# EAGLE schematic rosco_m68k (EAGLE 9.4.2)

## Sheet 1 of 6
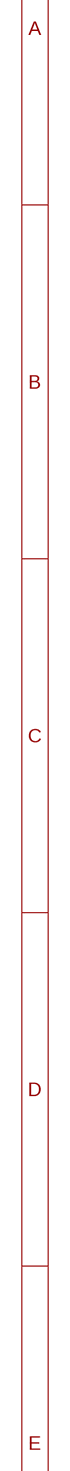
[diagram p0: schematic, sheet 1, part 1 of 2]
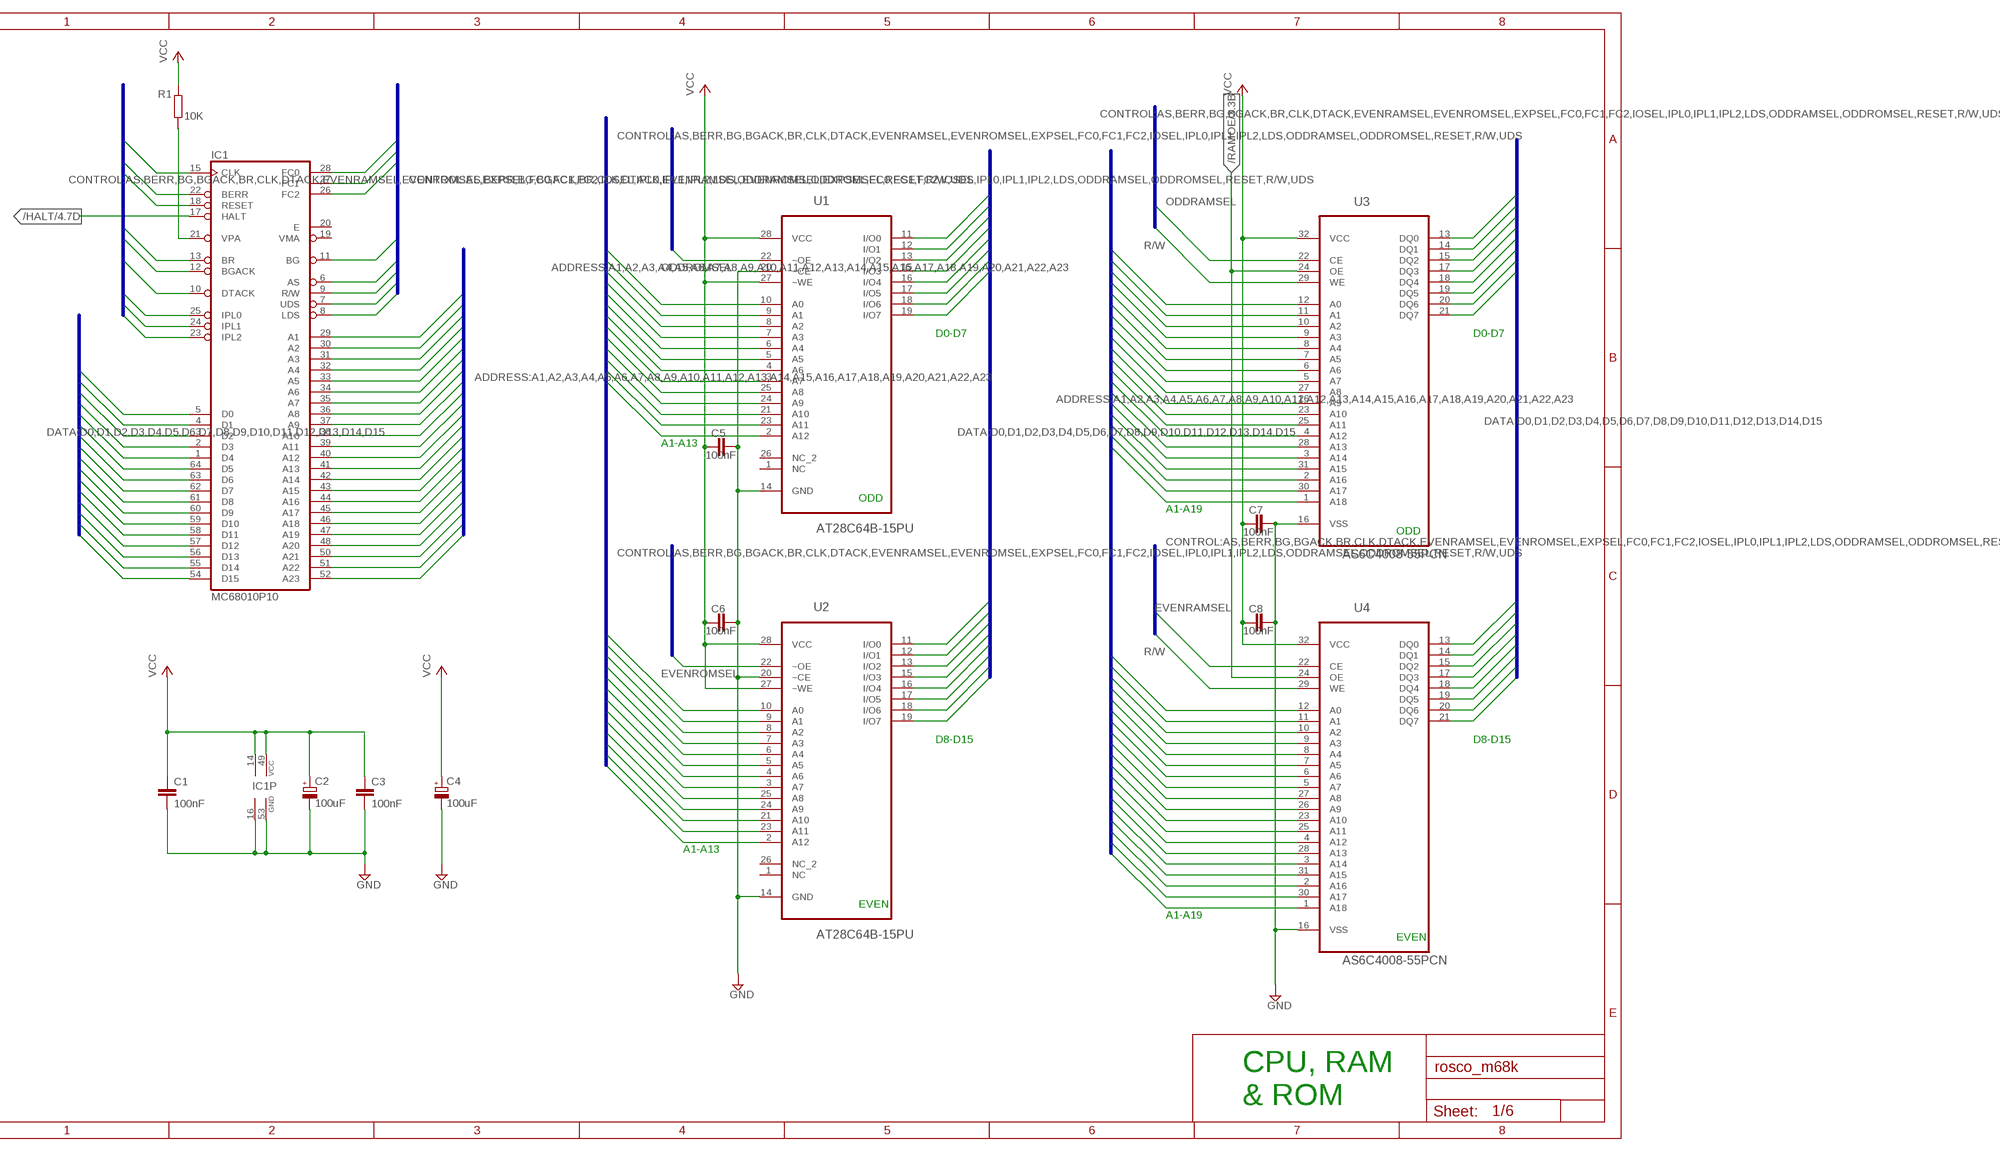
[diagram p1: schematic, sheet 1, part 2 of 2]

### Parts
C1  100nF  C2,5-3  [C2.5-3]
C2  100uF  CPOL-EUE2.5-5  [E2,5-5]
C3  100nF  C2,5-3  [C2.5-3]
C4  100uF  CPOL-EUE2.5-5  [E2,5-5]
C5  100nF  C2,5-3  [C2.5-3]
C6  100nF  C2,5-3  [C2.5-3]
C7  100nF  C2,5-3  [C2.5-3]
C8  100nF  C2,5-3  [C2.5-3]
IC1  MC68010P10  MC68000P  [DIL64]
R1  10K  R-EU_0207/10  [0207/10]
U1  AT28C64B-15PU  [DIP254P1524X482-28]
U2  AT28C64B-15PU  [DIP254P1524X482-28]
U3  AS6C4008-55PCN  [DIP254P1524X393-32]
U4  AS6C4008-55PCN  [DIP254P1524X393-32]

### Nets
/HALT: IC1.17(HALT) ; also sheet 4
/RAMOE: U3.24(OE) U4.24(OE) ; also sheet 3
A1: IC1.29(A1) U1.10(A0) U2.10(A0) U3.12(A0) U4.12(A0) ; also sheet 2,5
A2: IC1.30(A2) U1.9(A1) U2.9(A1) U3.11(A1) U4.11(A1) ; also sheet 2,5
A3: IC1.31(A3) U1.8(A2) U2.8(A2) U3.10(A2) U4.10(A2) ; also sheet 2,5
A4: IC1.32(A4) U1.7(A3) U2.7(A3) U3.9(A3) U4.9(A3) ; also sheet 2,5
A5: IC1.33(A5) U1.6(A4) U2.6(A4) U3.8(A4) U4.8(A4) ; also sheet 2,5
A6: IC1.34(A6) U1.5(A5) U2.5(A5) U3.7(A5) U4.7(A5) ; also sheet 5
A7: IC1.35(A7) U1.4(A6) U2.4(A6) U3.6(A6) U4.6(A6) ; also sheet 5
A8: IC1.36(A8) U1.3(A7) U2.3(A7) U3.5(A7) U4.5(A7) ; also sheet 5
A9: IC1.37(A9) U1.25(A8) U2.25(A8) U3.27(A8) U4.27(A8) ; also sheet 5
A10: IC1.38(A10) U1.24(A9) U2.24(A9) U3.26(A9) U4.26(A9) ; also sheet 5
A11: IC1.39(A11) U1.21(A10) U2.21(A10) U3.23(A10) U4.23(A10) ; also sheet 5
A12: IC1.40(A12) U1.23(A11) U2.23(A11) U3.25(A11) U4.25(A11) ; also sheet 5
A13: IC1.41(A13) U1.2(A12) U2.2(A12) U3.4(A12) U4.4(A12) ; also sheet 5
A14: IC1.42(A14) U3.28(A13) U4.28(A13) ; also sheet 5
A15: IC1.43(A15) U3.3(A14) U4.3(A14) ; also sheet 5
A16: IC1.44(A16) U3.31(A15) U4.31(A15) ; also sheet 5
A17: IC1.45(A17) U3.2(A16) U4.2(A16) ; also sheet 5
A18: IC1.46(A18) U3.30(A17) U4.30(A17) ; also sheet 2,5
A19: IC1.47(A19) U3.1(A18) U4.1(A18) ; also sheet 2,5
A20: IC1.48(A20) ; also sheet 2,5
A21: IC1.50(A21) ; also sheet 2,5
A22: IC1.51(A22) ; also sheet 2,5
A23: IC1.52(A23) ; also sheet 2,5
AS: IC1.6(AS) ; also sheet 2,3,5
BERR: IC1.22(BERR) ; also sheet 4,5
BG: IC1.11(BG) ; also sheet 5
BGACK: IC1.12(BGACK) ; also sheet 4,5
BR: IC1.13(BR) ; also sheet 4,5
CLK: IC1.15(CLK) ; also sheet 2,4,5
D0: IC1.5(D0) U1.11(I/O0) U3.13(DQ0) ; also sheet 2,5
D1: IC1.4(D1) U1.12(I/O1) U3.14(DQ1) ; also sheet 2,5
D2: IC1.3(D2) U1.13(I/O2) U3.15(DQ2) ; also sheet 2,5
D3: IC1.2(D3) U1.15(I/O3) U3.17(DQ3) ; also sheet 2,5
D4: IC1.1(D4) U1.16(I/O4) U3.18(DQ4) ; also sheet 2,5
D5: IC1.64(D5) U1.17(I/O5) U3.19(DQ5) ; also sheet 2,5
D6: IC1.63(D6) U1.18(I/O6) U3.20(DQ6) ; also sheet 2,5
D7: IC1.62(D7) U1.19(I/O7) U3.21(DQ7) ; also sheet 2,5
D8: IC1.61(D8) U2.11(I/O0) U4.13(DQ0) ; also sheet 5
D9: IC1.60(D9) U2.12(I/O1) U4.14(DQ1) ; also sheet 5
D10: IC1.59(D10) U2.13(I/O2) U4.15(DQ2) ; also sheet 5
D11: IC1.58(D11) U2.15(I/O3) U4.17(DQ3) ; also sheet 5
D12: IC1.57(D12) U2.16(I/O4) U4.18(DQ4) ; also sheet 5
D13: IC1.56(D13) U2.17(I/O5) U4.19(DQ5) ; also sheet 5
D14: IC1.55(D14) U2.18(I/O6) U4.20(DQ6) ; also sheet 5
D15: IC1.54(D15) U2.19(I/O7) U4.21(DQ7) ; also sheet 5
DTACK: IC1.10(DTACK) ; also sheet 3,5
EVENRAMSEL: U4.22(CE) ; also sheet 2,3,5
EVENROMSEL: U2.22(~OE) ; also sheet 2,3,5
FC0: IC1.28(FC0) ; also sheet 3,5
FC1: IC1.27(FC1) ; also sheet 3,5
FC2: IC1.26(FC2) ; also sheet 3,5
GND [power]: C1.2 C2.- C3.2 C4.- C5.2 C6.2 C7.2 C8.2 IC1.16(GND) IC1.53(GND) U1.14(GND) U1.20(~CE) U2.14(GND) U2.20(~CE) U3.16(VSS) U4.16(VSS) ; also sheet 2,3,4,5,6
IPL0: IC1.25(IPL0) ; also sheet 4,5
IPL1: IC1.24(IPL1) ; also sheet 4,5
IPL2: IC1.23(IPL2) ; also sheet 2,4,5
LDS: IC1.8(LDS) ; also sheet 2,3,5
ODDRAMSEL: U3.22(CE) ; also sheet 2,3,5
ODDROMSEL: U1.22(~OE) ; also sheet 2,3,5
R/W: IC1.9(R/W) U3.29(WE) U4.29(WE) ; also sheet 2,3,5
RESET: IC1.18(RESET) ; also sheet 2,3,4,5
UDS: IC1.7(UDS) ; also sheet 2,5
VCC [power]: C1.1 C2.+ C3.1 C4.+ C5.1 C6.1 C7.1 C8.1 IC1.14(VCC) IC1.49(VCC) R1.2 U1.27(~WE) U1.28(VCC) U2.27(~WE) U2.28(VCC) U3.32(VCC) U4.32(VCC) ; also sheet 2,3,4,5
VPA: IC1.21(VPA) R1.1
Unconnected: IC1.19(VMA) IC1.20(E) U1.1(NC) U1.26(NC_2) U2.1(NC) U2.26(NC_2)

### Buses
ADDRESS:A1,A2,A3,A4,A5,A6,A7,A8,A9,A10,A11,A12,A13,A14,A15,A16,A17,A18,A19,A20,A21,A22,A23
DATA:D0,D1,D2,D3,D4,D5,D6,D7,D8,D9,D10,D11,D12,D13,D14,D15
CONTROL:AS,BERR,BG,BGACK,BR,CLK,DTACK,EVENRAMSEL,EVENROMSEL,EXPSEL,FC0,FC1,FC2,IOSEL,IPL0,IPL1,IPL2,LDS,ODDRAMSEL,ODDROMSEL,RESET,R/W,UDS

### Notes on the sheet
- D0-D7 | D0-D7
- A1-A13
- ODD
- A1-A19
- ODD
- D8-D15 | D8-D15
- A1-A13
- EVEN
- A1-A19
- EVEN
- CPU, RAM
  & ROM

## Sheet 2 of 6
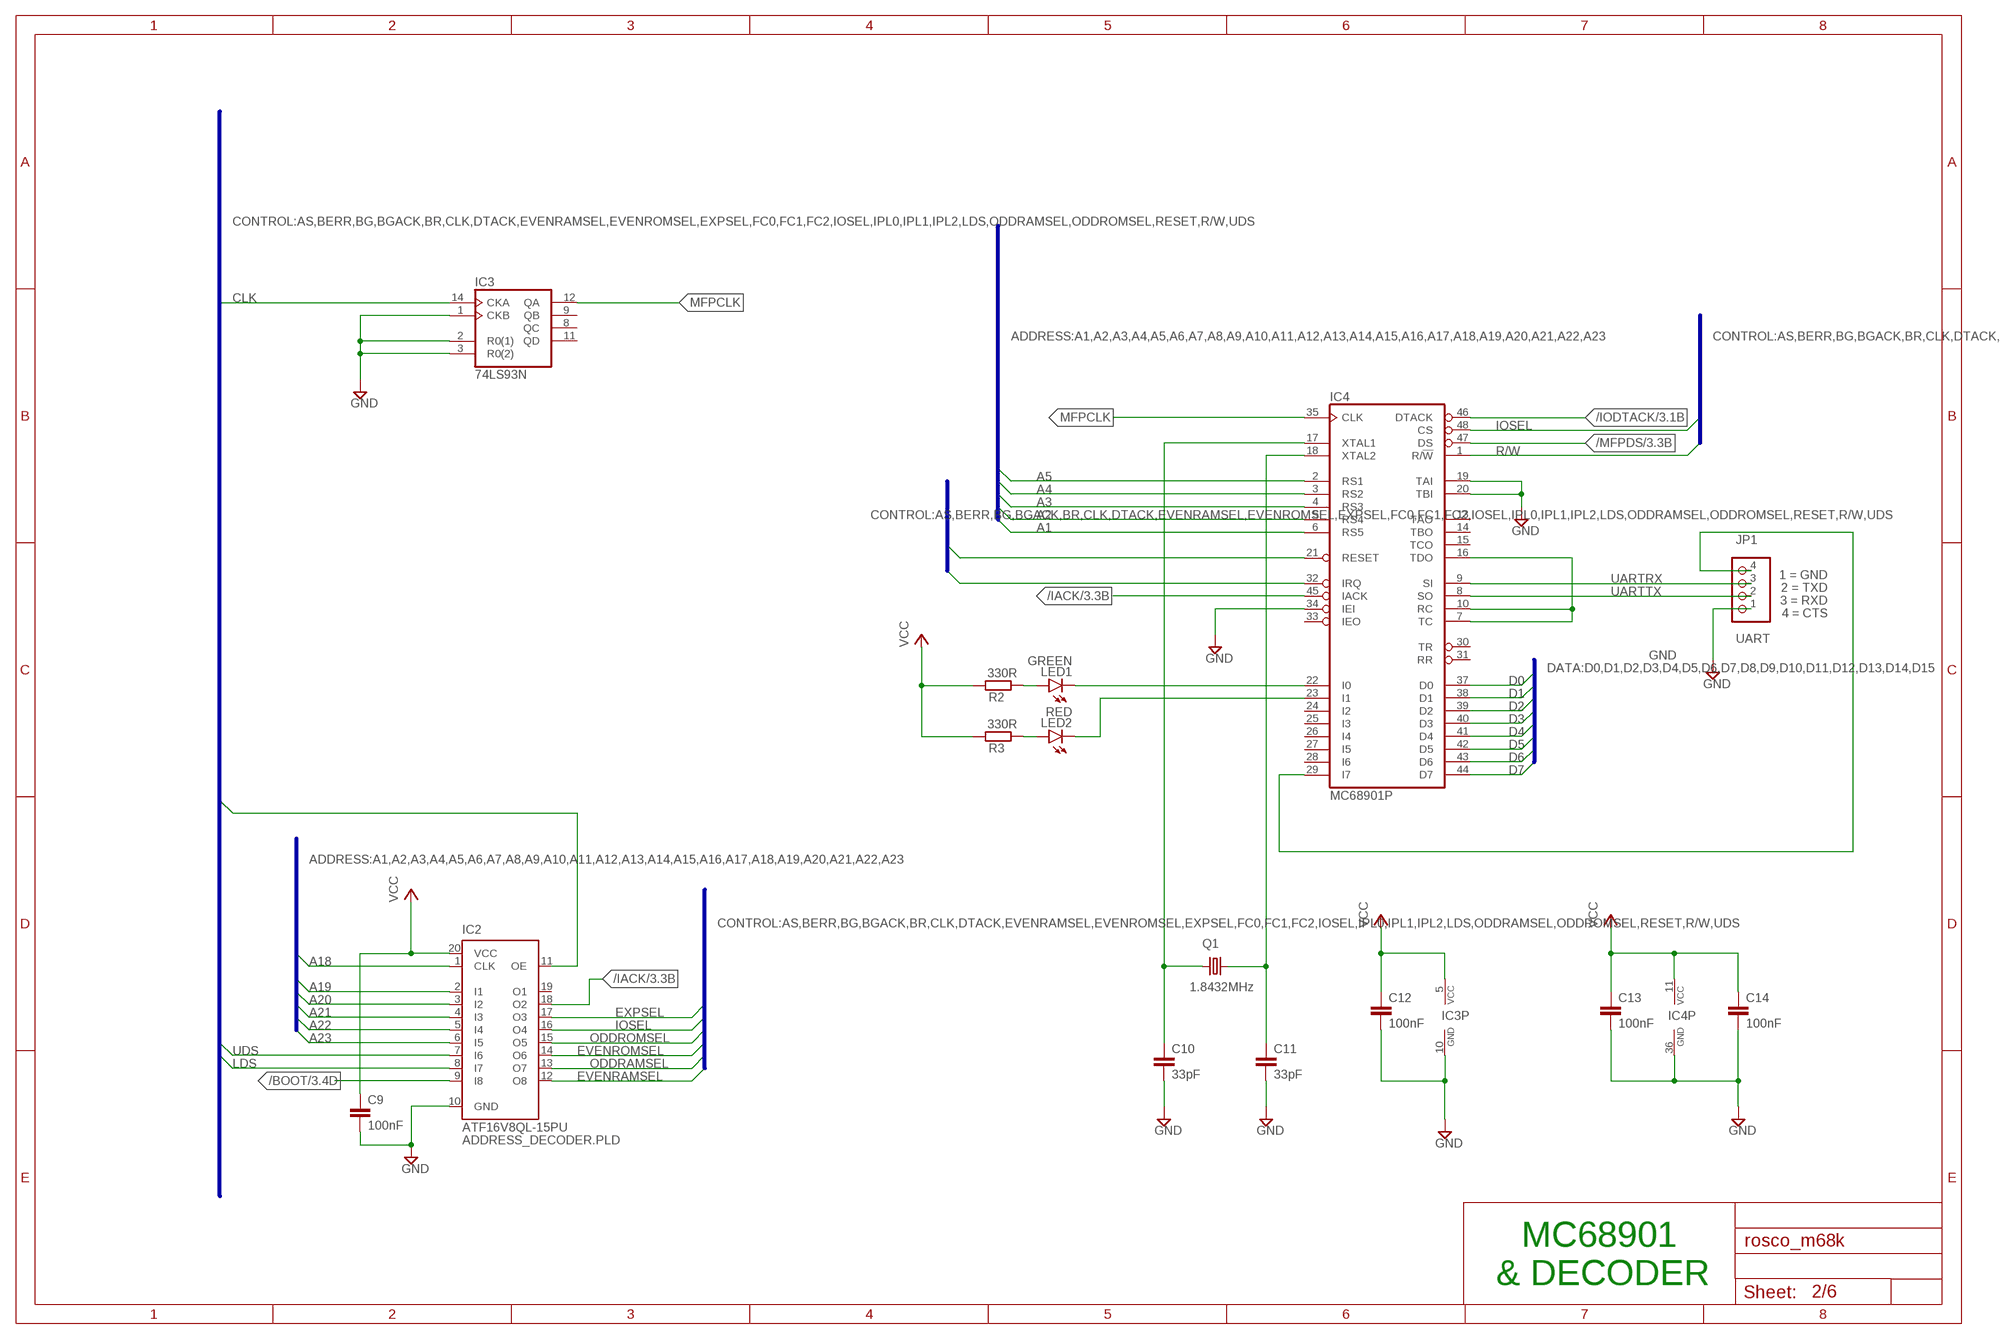
[diagram p2: schematic, sheet 2, part 1 of 2]
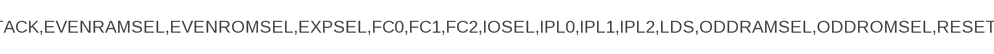
[diagram p3: schematic, sheet 2, part 2 of 2]

### Parts
C9  100nF  C2,5-3  [C2.5-3]
C10  33pF  C2,5-3  [C2.5-3]
C11  33pF  C2,5-3  [C2.5-3]
C12  100nF  C2,5-3  [C2.5-3]
C13  100nF  C2,5-3  [C2.5-3]
C14  100nF  C2,5-3  [C2.5-3]
IC2  ATF16V8QL-15PU  ATF16V8BP3  [DIL20]
IC3  74LS93N  [DIL14]
IC4  MC68901P  [DIL48]
JP1  UART  PINHD-1X4  [1X04]
LED1  GREEN  LED5MM  [LED5MM]
LED2  RED  LED5MM  [LED5MM]
Q1  1.8432MHz  CRYSTALHC49S  [HC49/S]
R2  330R  R-EU_0207/10  [0207/10]
R3  330R  R-EU_0207/10  [0207/10]

### Nets
/BOOT: IC2.9(I8) ; also sheet 3
/IACK: IC2.18(O2) IC4.45(IACK) ; also sheet 3
/IODTACK: IC4.46(DTACK) ; also sheet 3
/MFPDS: IC4.47(DS) ; also sheet 3
A1: IC4.6(RS5) ; also sheet 1,5
A2: IC4.5(RS4) ; also sheet 1,5
A3: IC4.4(RS3) ; also sheet 1,5
A4: IC4.3(RS2) ; also sheet 1,5
A5: IC4.2(RS1) ; also sheet 1,5
A18: IC2.1(CLK) ; also sheet 1,5
A19: IC2.2(I1) ; also sheet 1,5
A20: IC2.3(I2) ; also sheet 1,5
A21: IC2.4(I3) ; also sheet 1,5
A22: IC2.5(I4) ; also sheet 1,5
A23: IC2.6(I5) ; also sheet 1,5
AS: IC2.11(OE) ; also sheet 1,3,5
CLK: IC3.14(CKA) ; also sheet 1,4,5
D0: IC4.37(D0) ; also sheet 1,5
D1: IC4.38(D1) ; also sheet 1,5
D2: IC4.39(D2) ; also sheet 1,5
D3: IC4.40(D3) ; also sheet 1,5
D4: IC4.41(D4) ; also sheet 1,5
D5: IC4.42(D5) ; also sheet 1,5
D6: IC4.43(D6) ; also sheet 1,5
D7: IC4.44(D7) ; also sheet 1,5
EVENRAMSEL: IC2.12(O8) ; also sheet 1,3,5
EVENROMSEL: IC2.14(O6) ; also sheet 1,3,5
EXPSEL: IC2.17(O3) ; also sheet 5
GND [power]: C9.2 C10.2 C11.2 C12.2 C13.2 C14.2 IC2.10(GND) IC3.1(CKB) IC3.2(R0(1)) IC3.3(R0(2)) IC3.10(GND) IC4.19(TAI) IC4.20(TBI) IC4.34(IEI) IC4.36(GND) JP1.1 ; also sheet 1,3,4,5,6
IOSEL: IC2.16(O4) IC4.48(CS) ; also sheet 3,5
IPL2: IC4.32(IRQ) ; also sheet 1,4,5
LDS: IC2.8(I7) ; also sheet 1,3,5
MFPCLK: IC3.12(QA) IC4.35(CLK)
MFPIO0: IC4.22(I0) LED1.K(C)
MFPIO1: IC4.23(I1) LED2.K(C)
MFPXTAL1: C10.1 IC4.17(XTAL1) Q1.1
MFPXTAL2: C11.1 IC4.18(XTAL2) Q1.2
N$9: LED2.A R3.1
N$10: LED1.A R2.1
ODDRAMSEL: IC2.13(O7) ; also sheet 1,3,5
ODDROMSEL: IC2.15(O5) ; also sheet 1,3,5
R/W: IC4.1(R/!W) ; also sheet 1,3,5
RESET: IC4.21(RESET) ; also sheet 1,3,4,5
UARTCLK: IC4.7(TC) IC4.10(RC) IC4.16(TDO)
UARTCTS: IC4.29(I7) JP1.4
UARTRX: IC4.9(SI) JP1.3
UARTTX: IC4.8(SO) JP1.2
UDS: IC2.7(I6) ; also sheet 1,5
VCC [power]: C9.1 C12.1 C13.1 C14.1 IC2.20(VCC) IC3.5(VCC) IC4.11(VCC) R2.2 R3.2 ; also sheet 1,3,4,5
Unconnected: IC2.19(O1) IC3.8(QC) IC3.9(QB) IC3.11(QD) IC4.13(TAO) IC4.14(TBO) IC4.15(TCO) IC4.24(I2) IC4.25(I3) IC4.26(I4) IC4.27(I5) IC4.28(I6) IC4.30(TR) IC4.31(RR) IC4.33(IEO)

### Buses
ADDRESS:A1,A2,A3,A4,A5,A6,A7,A8,A9,A10,A11,A12,A13,A14,A15,A16,A17,A18,A19,A20,A21,A22,A23
CONTROL:AS,BERR,BG,BGACK,BR,CLK,DTACK,EVENRAMSEL,EVENROMSEL,EXPSEL,FC0,FC1,FC2,IOSEL,IPL0,IPL1,IPL2,LDS,ODDRAMSEL,ODDROMSEL,RESET,R/W,UDS
DATA:D0,D1,D2,D3,D4,D5,D6,D7,D8,D9,D10,D11,D12,D13,D14,D15

### Notes on the sheet
- MC68901
- & DECODER

## Sheet 3 of 6
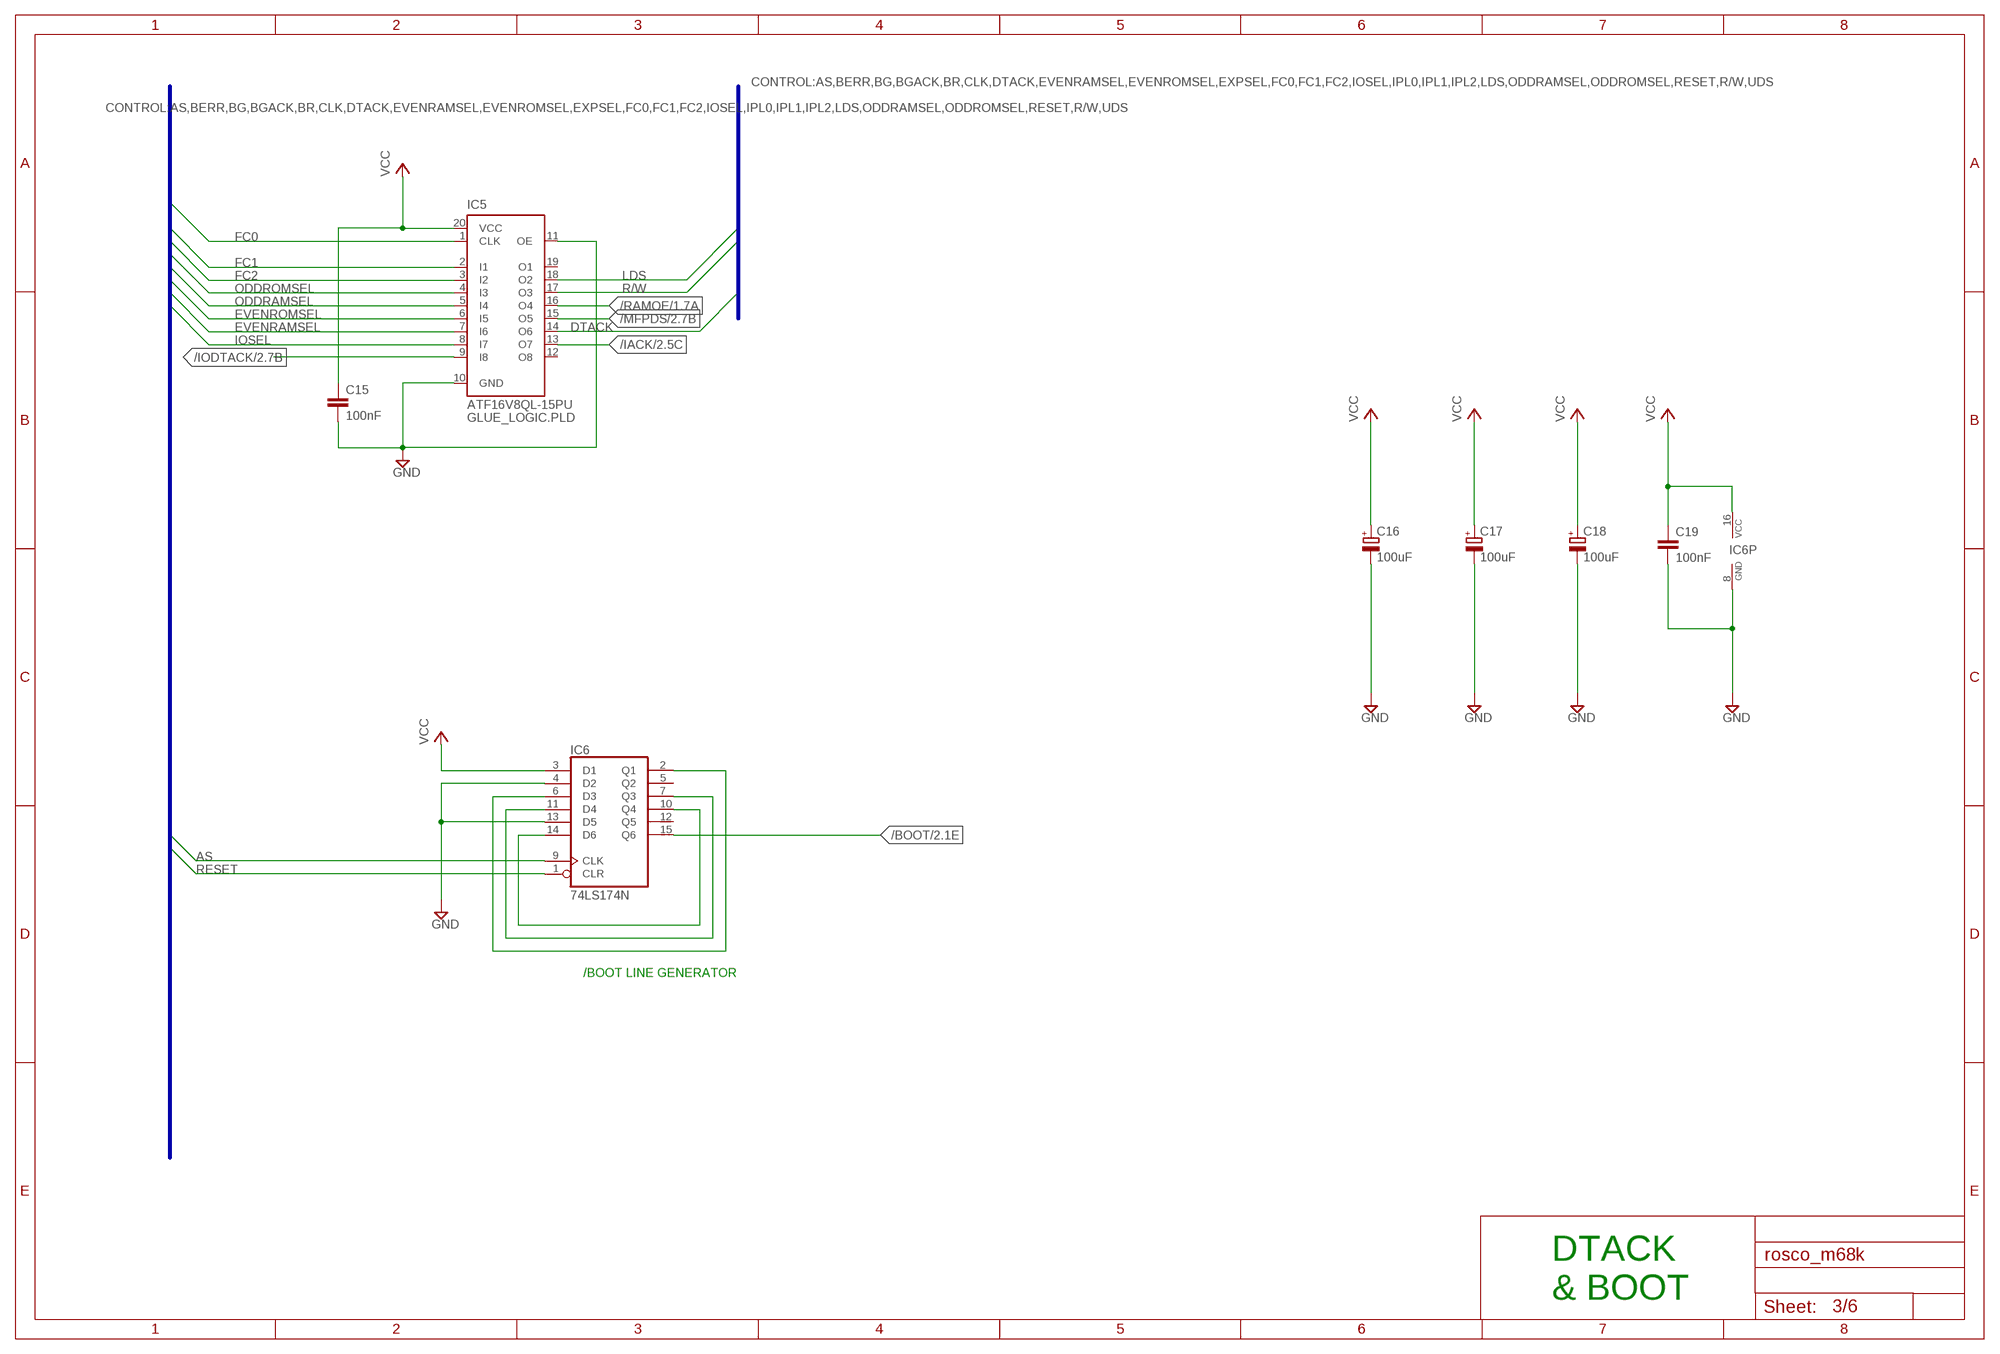
[diagram p4: schematic, sheet 3]

### Parts
C15  100nF  C2,5-3  [C2.5-3]
C16  100uF  CPOL-EUE2.5-5  [E2,5-5]
C17  100uF  CPOL-EUE2.5-5  [E2,5-5]
C18  100uF  CPOL-EUE2.5-5  [E2,5-5]
C19  100nF  C2,5-3  [C2.5-3]
IC5  ATF16V8QL-15PU  ATF16V8BP3  [DIL20]
IC6  74LS174N  [DIL16]

### Nets
/BOOT: IC6.15(Q6) ; also sheet 2
/IACK: IC5.13(O7) ; also sheet 2
/IODTACK: IC5.9(I8) ; also sheet 2
/MFPDS: IC5.15(O5) ; also sheet 2
/RAMOE: IC5.16(O4) ; also sheet 1
AS: IC6.9(CLK) ; also sheet 1,2,5
DTACK: IC5.14(O6) ; also sheet 1,5
EVENRAMSEL: IC5.7(I6) ; also sheet 1,2,5
EVENROMSEL: IC5.6(I5) ; also sheet 1,2,5
FC0: IC5.1(CLK) ; also sheet 1,5
FC1: IC5.2(I1) ; also sheet 1,5
FC2: IC5.3(I2) ; also sheet 1,5
GND [power]: C15.2 C16.- C17.- C18.- C19.2 IC5.10(GND) IC5.11(OE) IC6.4(D2) IC6.8(GND) IC6.13(D5) ; also sheet 1,2,4,5,6
IOSEL: IC5.8(I7) ; also sheet 2,5
LDS: IC5.18(O2) ; also sheet 1,2,5
N$16: IC6.7(Q3) IC6.11(D4)
N$22: IC6.10(Q4) IC6.14(D6)
N$23: IC6.2(Q1) IC6.6(D3)
ODDRAMSEL: IC5.5(I4) ; also sheet 1,2,5
ODDROMSEL: IC5.4(I3) ; also sheet 1,2,5
R/W: IC5.17(O3) ; also sheet 1,2,5
RESET: IC6.1(CLR) ; also sheet 1,2,4,5
VCC [power]: C15.1 C16.+ C17.+ C18.+ C19.1 IC5.20(VCC) IC6.3(D1) IC6.16(VCC) ; also sheet 1,2,4,5
Unconnected: IC5.12(O8) IC5.19(O1) IC6.5(Q2) IC6.12(Q5)

### Buses
CONTROL:AS,BERR,BG,BGACK,BR,CLK,DTACK,EVENRAMSEL,EVENROMSEL,EXPSEL,FC0,FC1,FC2,IOSEL,IPL0,IPL1,IPL2,LDS,ODDRAMSEL,ODDROMSEL,RESET,R/W,UDS

### Notes on the sheet
- /BOOT LINE GENERATOR
- DTACK
  & BOOT

## Sheet 4 of 6
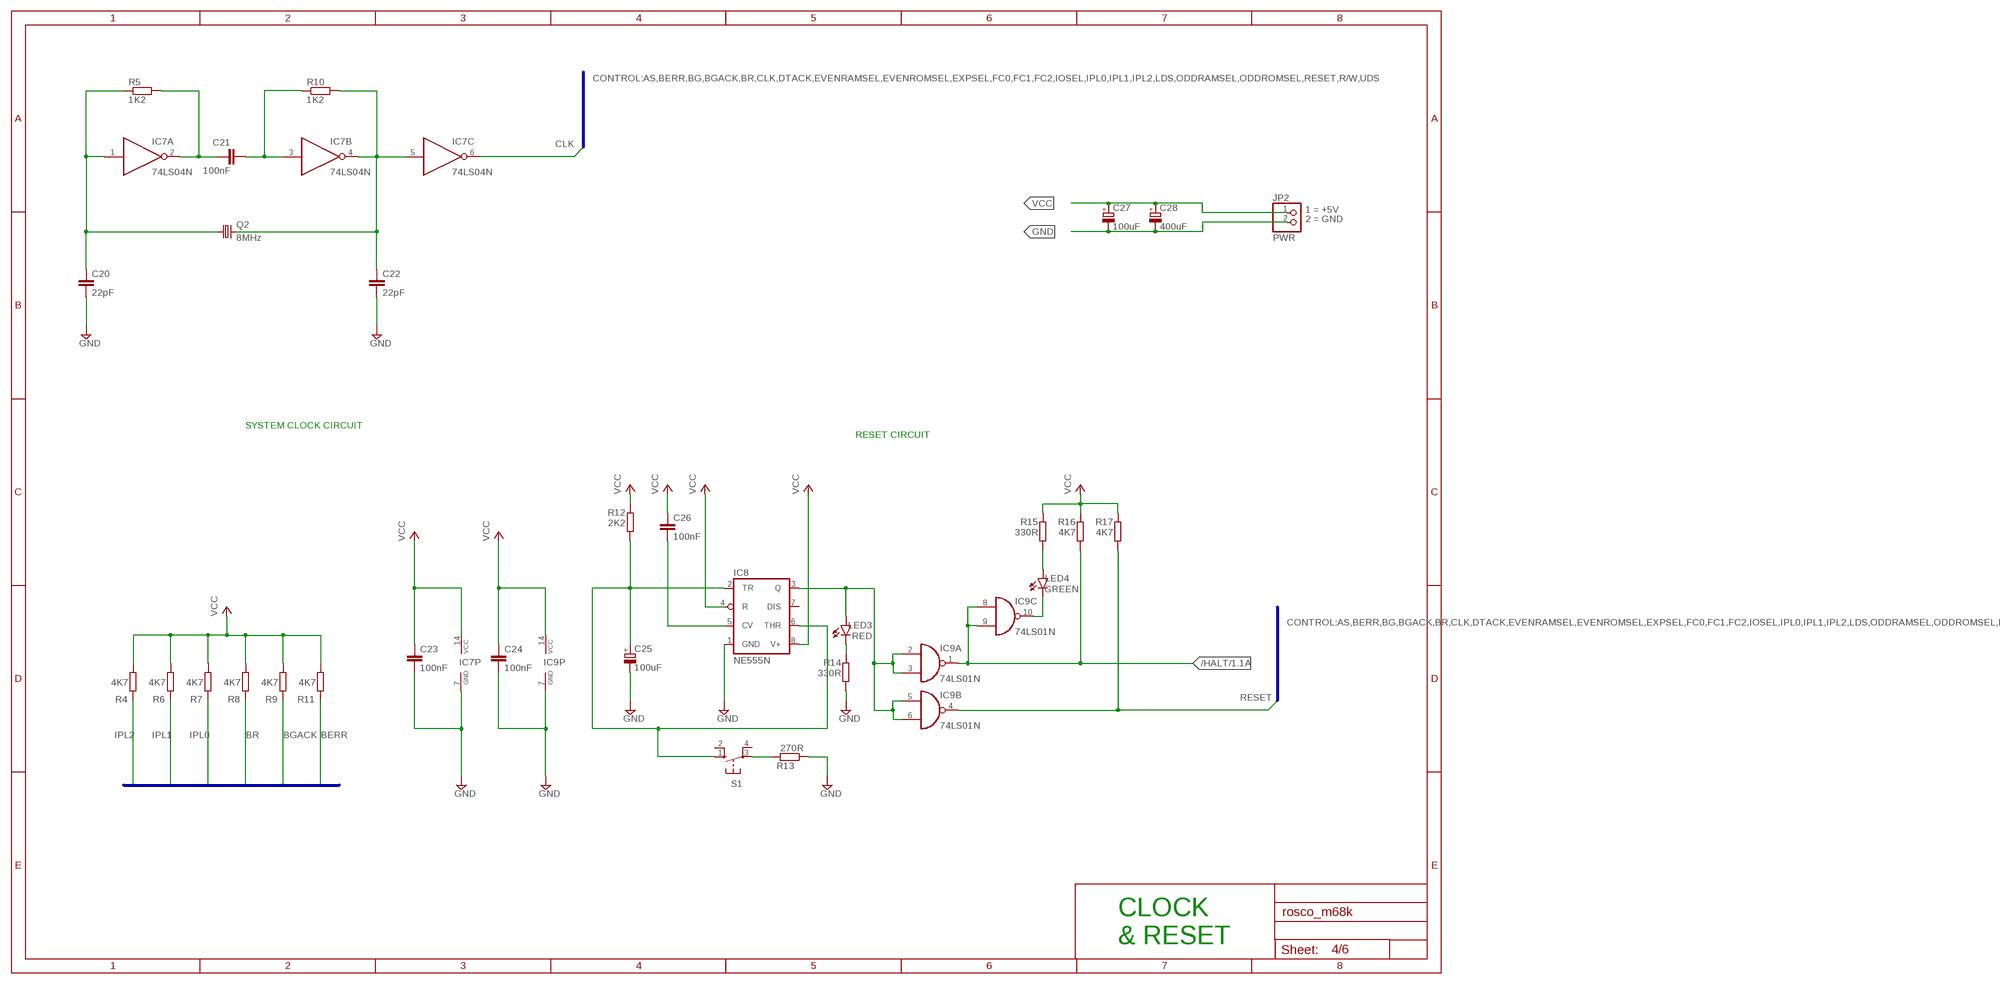
[diagram p5: schematic, sheet 4]

### Parts
C20  22pF  C2,5-3  [C2.5-3]
C21  100nF  C2,5-3  [C2.5-3]
C22  22pF  C2,5-3  [C2.5-3]
C23  100nF  C2,5-3  [C2.5-3]
C24  100nF  C2,5-3  [C2.5-3]
C25  100uF  CPOL-EUE2.5-5  [E2,5-5]
C26  100nF  C2,5-3  [C2.5-3]
C27  100uF  CPOL-EUE2.5-5  [E2,5-5]
C28  400uF  CPOL-EUE3.5-10  [E3,5-10]
IC7  74LS04N  [DIL14]
IC8  NE555N  [DIL08]
IC9  74LS01N  [DIL14]
JP2  PWR  PINHD-1X2  [1X02]
LED3  RED  LED5MM  [LED5MM]
LED4  GREEN  LED5MM  [LED5MM]
Q2  8MHz  CRYSTALHC49S  [HC49/S]
R4  4K7  R-EU_0207/10  [0207/10]
R5  1K2  R-EU_0207/10  [0207/10]
R6  4K7  R-EU_0207/10  [0207/10]
R7  4K7  R-EU_0207/10  [0207/10]
R8  4K7  R-EU_0207/10  [0207/10]
R9  4K7  R-EU_0207/10  [0207/10]
R10  1K2  R-EU_0207/10  [0207/10]
R11  4K7  R-EU_0207/10  [0207/10]
R12  2K2  R-EU_0207/10  [0207/10]
R13  270R  R-EU_0207/10  [0207/10]
R14  330R  R-EU_0207/10  [0207/10]
R15  330R  R-EU_0207/10  [0207/10]
R16  4K7  R-EU_0207/10  [0207/10]
R17  4K7  R-EU_0207/10  [0207/10]
S1  10-XX  [B3F-10XX]

### Nets
/HALT: IC9.1(A:O) IC9.8(C:I0) IC9.9(C:I1) R16.1 ; also sheet 1
BERR: R11.1 ; also sheet 1,5
BGACK: R9.1 ; also sheet 1,5
BR: R8.1 ; also sheet 1,5
CLK: IC7.6(C:O) ; also sheet 1,2,5
GND [power]: C20.2 C22.2 C23.2 C24.2 C25.- C27.- C28.- IC7.7(P:GND) IC8.1(GND) IC9.7(P:GND) JP2.2 R13.1 R14.1 ; also sheet 1,2,3,5,6
IPL0: R7.1 ; also sheet 1,5
IPL1: R6.1 ; also sheet 1,5
IPL2: R4.1 ; also sheet 1,2,5
N$3: C21.1 IC7.2(A:O) R5.2
N$4: C21.2 IC7.3(B:I) R10.1
N$5: C22.1 IC7.4(B:O) IC7.5(C:I) Q2.2 R10.2
N$6: C20.1 IC7.1(A:I) Q2.1 R5.1
N$19: C26.2 IC8.5(CV)
N$20: LED3.K(C) R14.2
N$33: IC9.10(C:O) LED4.K(C)
N$34: LED4.A R15.1
N$35: IC8.3(Q) IC9.2(A:I0) IC9.3(A:I1) IC9.5(B:I0) IC9.6(B:I1) LED3.A
N$36: R13.2 S1.3(P)
N$37: C25.+ IC8.2(TR) IC8.6(THR) R12.1 S1.1(S)
RESET: IC9.4(B:O) R17.1 ; also sheet 1,2,3,5
VCC [power]: C23.1 C24.1 C26.1 C27.+ C28.+ IC7.14(P:VCC) IC8.4(R) IC8.8(V+) IC9.14(P:VCC) JP2.1 R4.2 R6.2 R7.2 R8.2 R9.2 R11.2 R12.2 R15.2 R16.2 R17.2 ; also sheet 1,2,3,5
Unconnected: IC8.7(DIS) S1.2(S1) S1.4(P1)

### Buses
CONTROL:AS,BERR,BG,BGACK,BR,CLK,DTACK,EVENRAMSEL,EVENROMSEL,EXPSEL,FC0,FC1,FC2,IOSEL,IPL0,IPL1,IPL2,LDS,ODDRAMSEL,ODDROMSEL,RESET,R/W,UDS

### Notes on the sheet
- SYSTEM CLOCK CIRCUIT
- RESET CIRCUIT
- CLOCK
  & RESET

## Sheet 5 of 6
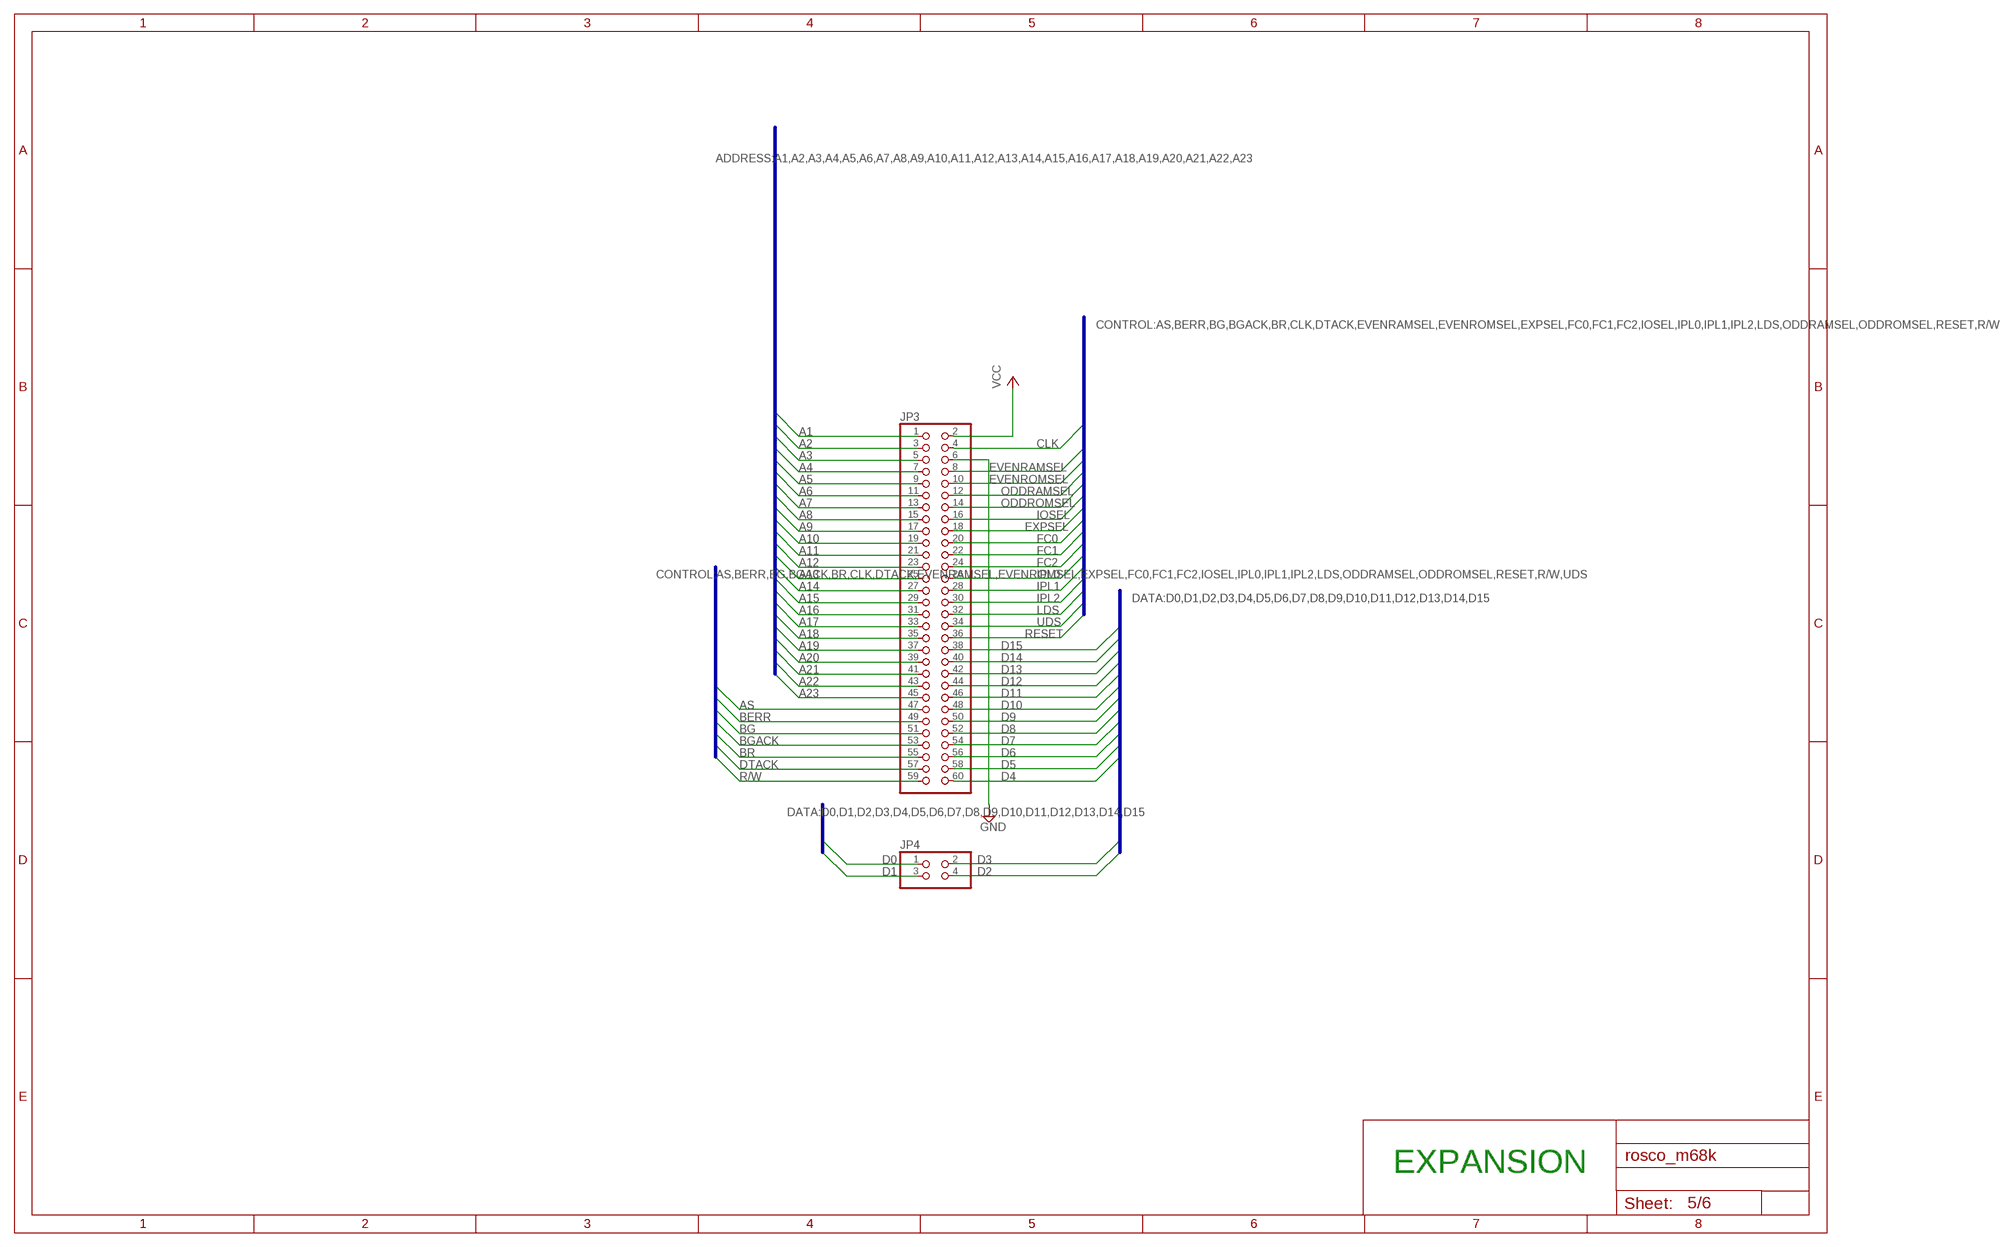
[diagram p6: schematic, sheet 5]

### Parts
JP3  PINHD-2X30  [2X30]
JP4  PINHD-2X2  [2X02]

### Nets
A1: JP3.1 ; also sheet 1,2
A2: JP3.3 ; also sheet 1,2
A3: JP3.5 ; also sheet 1,2
A4: JP3.7 ; also sheet 1,2
A5: JP3.9 ; also sheet 1,2
A6: JP3.11 ; also sheet 1
A7: JP3.13 ; also sheet 1
A8: JP3.15 ; also sheet 1
A9: JP3.17 ; also sheet 1
A10: JP3.19 ; also sheet 1
A11: JP3.21 ; also sheet 1
A12: JP3.23 ; also sheet 1
A13: JP3.25 ; also sheet 1
A14: JP3.27 ; also sheet 1
A15: JP3.29 ; also sheet 1
A16: JP3.31 ; also sheet 1
A17: JP3.33 ; also sheet 1
A18: JP3.35 ; also sheet 1,2
A19: JP3.37 ; also sheet 1,2
A20: JP3.39 ; also sheet 1,2
A21: JP3.41 ; also sheet 1,2
A22: JP3.43 ; also sheet 1,2
A23: JP3.45 ; also sheet 1,2
AS: JP3.47 ; also sheet 1,2,3
BERR: JP3.49 ; also sheet 1,4
BG: JP3.51 ; also sheet 1
BGACK: JP3.53 ; also sheet 1,4
BR: JP3.55 ; also sheet 1,4
CLK: JP3.4 ; also sheet 1,2,4
D0: JP4.1 ; also sheet 1,2
D1: JP4.3 ; also sheet 1,2
D2: JP4.4 ; also sheet 1,2
D3: JP4.2 ; also sheet 1,2
D4: JP3.60 ; also sheet 1,2
D5: JP3.58 ; also sheet 1,2
D6: JP3.56 ; also sheet 1,2
D7: JP3.54 ; also sheet 1,2
D8: JP3.52 ; also sheet 1
D9: JP3.50 ; also sheet 1
D10: JP3.48 ; also sheet 1
D11: JP3.46 ; also sheet 1
D12: JP3.44 ; also sheet 1
D13: JP3.42 ; also sheet 1
D14: JP3.40 ; also sheet 1
D15: JP3.38 ; also sheet 1
DTACK: JP3.57 ; also sheet 1,3
EVENRAMSEL: JP3.8 ; also sheet 1,2,3
EVENROMSEL: JP3.10 ; also sheet 1,2,3
EXPSEL: JP3.18 ; also sheet 2
FC0: JP3.20 ; also sheet 1,3
FC1: JP3.22 ; also sheet 1,3
FC2: JP3.24 ; also sheet 1,3
GND [power]: JP3.6 ; also sheet 1,2,3,4,6
IOSEL: JP3.16 ; also sheet 2,3
IPL0: JP3.26 ; also sheet 1,4
IPL1: JP3.28 ; also sheet 1,4
IPL2: JP3.30 ; also sheet 1,2,4
LDS: JP3.32 ; also sheet 1,2,3
ODDRAMSEL: JP3.12 ; also sheet 1,2,3
ODDROMSEL: JP3.14 ; also sheet 1,2,3
R/W: JP3.59 ; also sheet 1,2,3
RESET: JP3.36 ; also sheet 1,2,3,4
UDS: JP3.34 ; also sheet 1,2
VCC [power]: JP3.2 ; also sheet 1,2,3,4

### Buses
ADDRESS:A1,A2,A3,A4,A5,A6,A7,A8,A9,A10,A11,A12,A13,A14,A15,A16,A17,A18,A19,A20,A21,A22,A23
CONTROL:AS,BERR,BG,BGACK,BR,CLK,DTACK,EVENRAMSEL,EVENROMSEL,EXPSEL,FC0,FC1,FC2,IOSEL,IPL0,IPL1,IPL2,LDS,ODDRAMSEL,ODDROMSEL,RESET,R/W,UDS
DATA:D0,D1,D2,D3,D4,D5,D6,D7,D8,D9,D10,D11,D12,D13,D14,D15

### Notes on the sheet
- EXPANSION

## Sheet 6 of 6
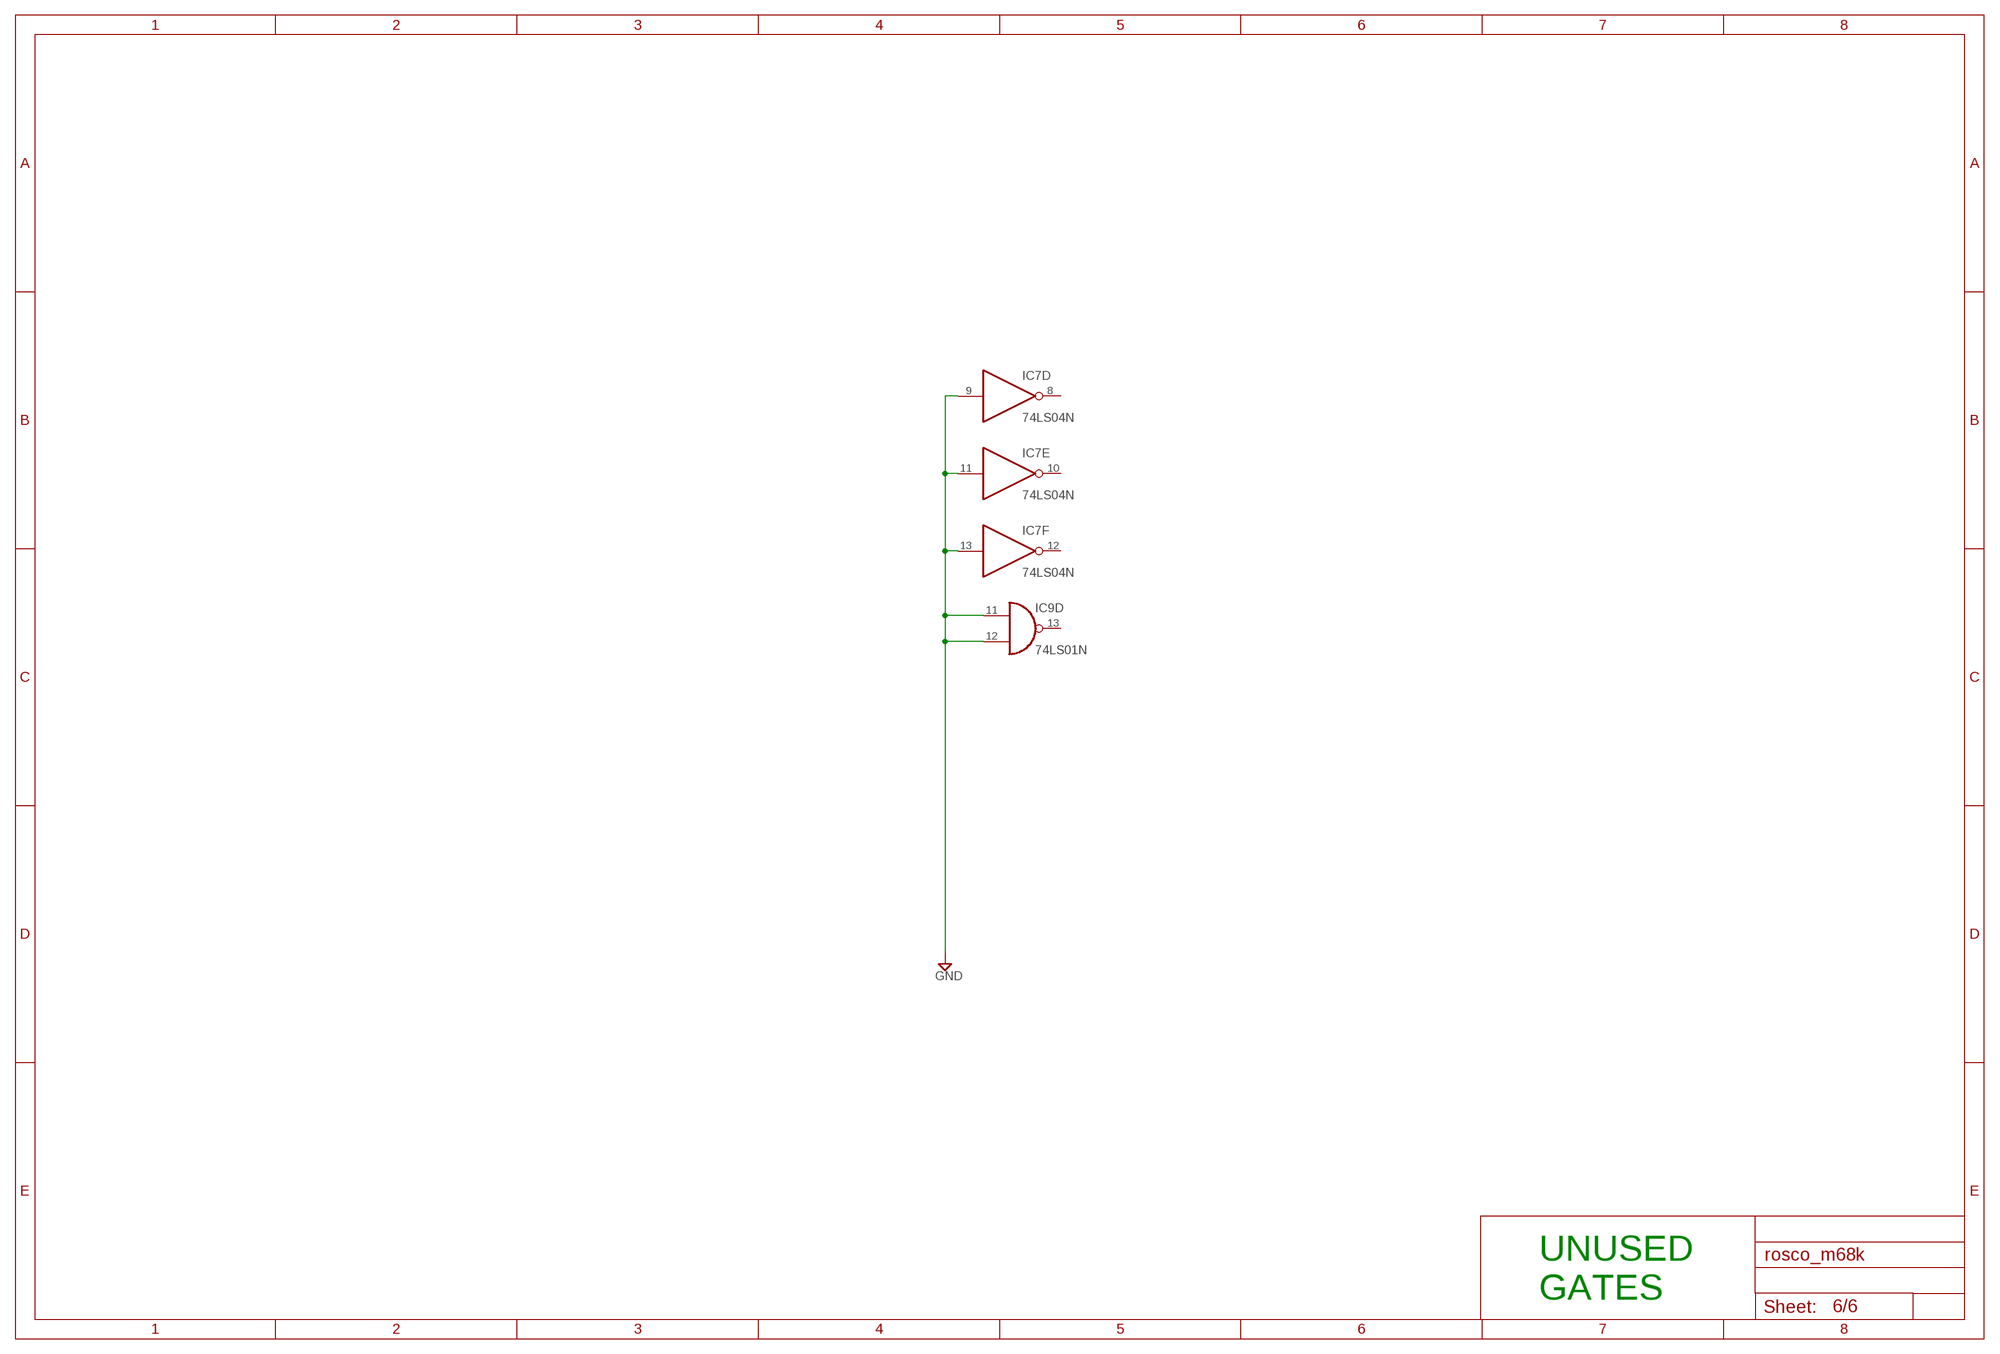
[diagram p7: schematic, sheet 6]

### Nets
GND [power]: IC7.9(D:I) IC7.11(E:I) IC7.13(F:I) IC9.11(D:I0) IC9.12(D:I1) ; also sheet 1,2,3,4,5
Unconnected: IC7.8(D:O) IC7.10(E:O) IC7.12(F:O) IC9.13(D:O)

### Notes on the sheet
- UNUSED
  GATES

## Library data of the parts
C1 C3 C5-C15 C19-C24 C26 = capacitor-wima:C: CAPACITOR naming: grid - package width
C2 C4 C16-C18 C25 C27 C28 = rcl:CPOL-EU: POLARIZED CAPACITOR, European symbol; SPICEPREFIX: C
IC1 = micro-mc68000:MC68000P: 68xxx PROCESSOR; OC_FARNELL: unknown; OC_NEWARK: unknown
IC2 = atmel:ATF16V8B: High perfomance CMOS (electrically erasable) programmable logic device (PLD) ABLE-Atmel-ABEL - P18V8R, P16V8C, P16V8AS, P17V8 COPL Atmel-WinCUPL - G16V8MS, G16V8MA, G16V8AS, G16V8 LOG/IC - GAL16V8_R, GAL16V8_G7, GAL16V8_C), GAL16V8 Tango-PLD - G16V8R, G16V8C, G16V8AS, G16V8 Source: http://www.atmel.com/dyn/resources/prod_documents/DOC0364.PDF; MPN: ATF16V8QL-15PU; OC_FARNELL: 1551768; OC_NEWARK: 94M6254; PROG: ADDRESS_DECODER.PLD
IC3 = 74xx-eu:74*93: Decade, divide by twelve and binary COUNTER
IC4 = micro-mc68000:MC68901P: 68xxx PROCESSOR; OC_FARNELL: unknown; OC_NEWARK: unknown
IC5 = atmel:ATF16V8B: High perfomance CMOS (electrically erasable) programmable logic device (PLD) ABLE-Atmel-ABEL - P18V8R, P16V8C, P16V8AS, P17V8 COPL Atmel-WinCUPL - G16V8MS, G16V8MA, G16V8AS, G16V8 LOG/IC - GAL16V8_R, GAL16V8_G7, GAL16V8_C), GAL16V8 Tango-PLD - G16V8R, G16V8C, G16V8AS, G16V8 Source: http://www.atmel.com/dyn/resources/prod_documents/DOC0364.PDF; MPN: ATF16V8QL-15PU; OC_FARNELL: 1551768; OC_NEWARK: 94M6254; PROG: GLUE_LOGIC.PLD
IC6 = 74xx-eu:74*174: Hex D type FLIP FLOP, clear
IC7 = 74xx-eu:74*04: Hex INVERTER
IC8 = linear:*555: TIMER
IC9 = 74xx-eu:74*01: Quad 2-input NAND gate, open collector
JP1 = pinhead:PINHD-1X4: PIN HEADER; 1: GND; 2: TXD; 3: RXD; 4: CTS
JP2 = pinhead:PINHD-1X2: PIN HEADER; 1: +5V; 2: GND
JP3 = pinhead:PINHD-2X30: PIN HEADER
JP4 = pinhead:PINHD-2X2: PIN HEADER
LED1-LED4 = led:LED: LED OSRAM: - CHIPLED LG R971, LG N971, LY N971, LG Q971, LY Q971, LO R971, LY R971 LH N974, LH R974 LS Q976, LO Q976, LY Q976 LO Q996 - Hyper CHIPLED LW Q18S LB Q993, LB Q99A, LB R99A - SideLED LS A670, LO A670, LY A670, LG A670, LP A670 LB A673, LV A673, LT A673, LW A673 LH A674 LY A675 LS A676, LA A676, LO A676, LY A676, LW A676 LS A679, LY A679, LG A679 - Hyper Micro SIDELED® LS Y876, LA Y876, LO Y876, LY Y876 LT Y87S - SmartLED LW L88C, LW L88S LB L89C, LB L89S, LG L890 LS L89K, LO L89K, LY L89K LS L896, LA L896, LO L896, LY L896 - TOPLED LS T670, LO T670, LY T670, LG T670, LP T670 LSG T670, LSP T670, LSY T670, LOP T670, LYG T670 LG T671, LOG T671, LSG T671 LB T673, LV T673, LT T673, LW T673 LH T674 LS T676, LA T676, LO T676, LY T676, LB T676, LH T676, LSB T676, LW T676 LB T67C, LV T67C, LT T67C, LS T67K, LO T67K, LY T67K, LW E67C LS E67B, LA E67B, LO E67B, LY E67B, LB E67C, LV E67C, LT E67C LW T67C LS T679, LY T679, LG T679 LS T770, LO T770, LY T770, LG T770, LP T770 LB T773, LV T773, LT T773, LW T773 LH T774 LS E675, LA E675, LY E675, LS T675 LS T776, LA T776, LO T776, LY T776, LB T776 LHGB T686 LT T68C, LB T68C - Hyper Mini TOPLED® LB M676 - Mini TOPLED Santana® LG M470 LS M47K, LO M47K, LY M47K Source: http://www.osram.convergy.de LUXEON: - LUMILED® LXK2-PW12-R00, LXK2-PW12-S00, LXK2-PW14-U00, LXK2-PW14-V00 LXK2-PM12-R00, LXK2-PM12-S00, LXK2-PM14-U00 LXK2-PE12-Q00, LXK2-PE12-R00, LXK2-PE12-S00, LXK2-PE14-T00, LXK2-PE14-U00 LXK2-PB12-K00, LXK2-PB12-L00, LXK2-PB12-M00, LXK2-PB14-N00, LXK2-PB14-P00, LXK2-PB14-Q00 LXK2-PR12-L00, LXK2-PR12-M00, LXK2-PR14-Q00, LXK2-PR14-R00 LXK2-PD12-Q00, LXK2-PD12-R00, LXK2-PD12-S00 LXK2-PH12-R00, LXK2-PH12-S00 LXK2-PL12-P00, LXK2-PL12-Q00, LXK2-PL12-R00 Source: www.luxeon.com KINGBRIGHT: KA-3528ASYC Source: www.kingbright.com
Q1 Q2 = crystal:CRYSTAL: CRYSTAL; OC_FARNELL: 1667008; OC_NEWARK: unknown
R1-R17 = rcl:R-EU_: RESISTOR, European symbol; SPICEPREFIX: R
S1 = switch-omron:10-XX: OMRON SWITCH; MPN: B3F-1000; OC_FARNELL: 176432; OC_NEWARK: 36M3542
U1 U2 = Atmel_By_element14_Batch_1-00:AT28C64B-15PU: Parallel EEPROM; DESCRIPTION: Parallel EEPROM; MPN: AT28C64B-15PU; OC_FARNELL: 1095784; OC_NEWARK: 96K6557; PACKAGE: PCDIP-28; SUPPLIER: ATMEL
U3 U4 = Alliance_By_element14:AS6C4008-55PCN: CMOS SRAM; MPN: AS6C4008-55PCN; OC_FARNELL: 1562900; OC_NEWARK: 94M6217; PACKAGE: DIP-32; SUPPLIER: ALLIANCE MEMORY

## Net classes
1 power: width 0.254 mm, clearance 0.254 mm